# Altium schematic sheet Sheet3.SchDoc
size A3; SheetNumber: 3; SheetTotal: 4
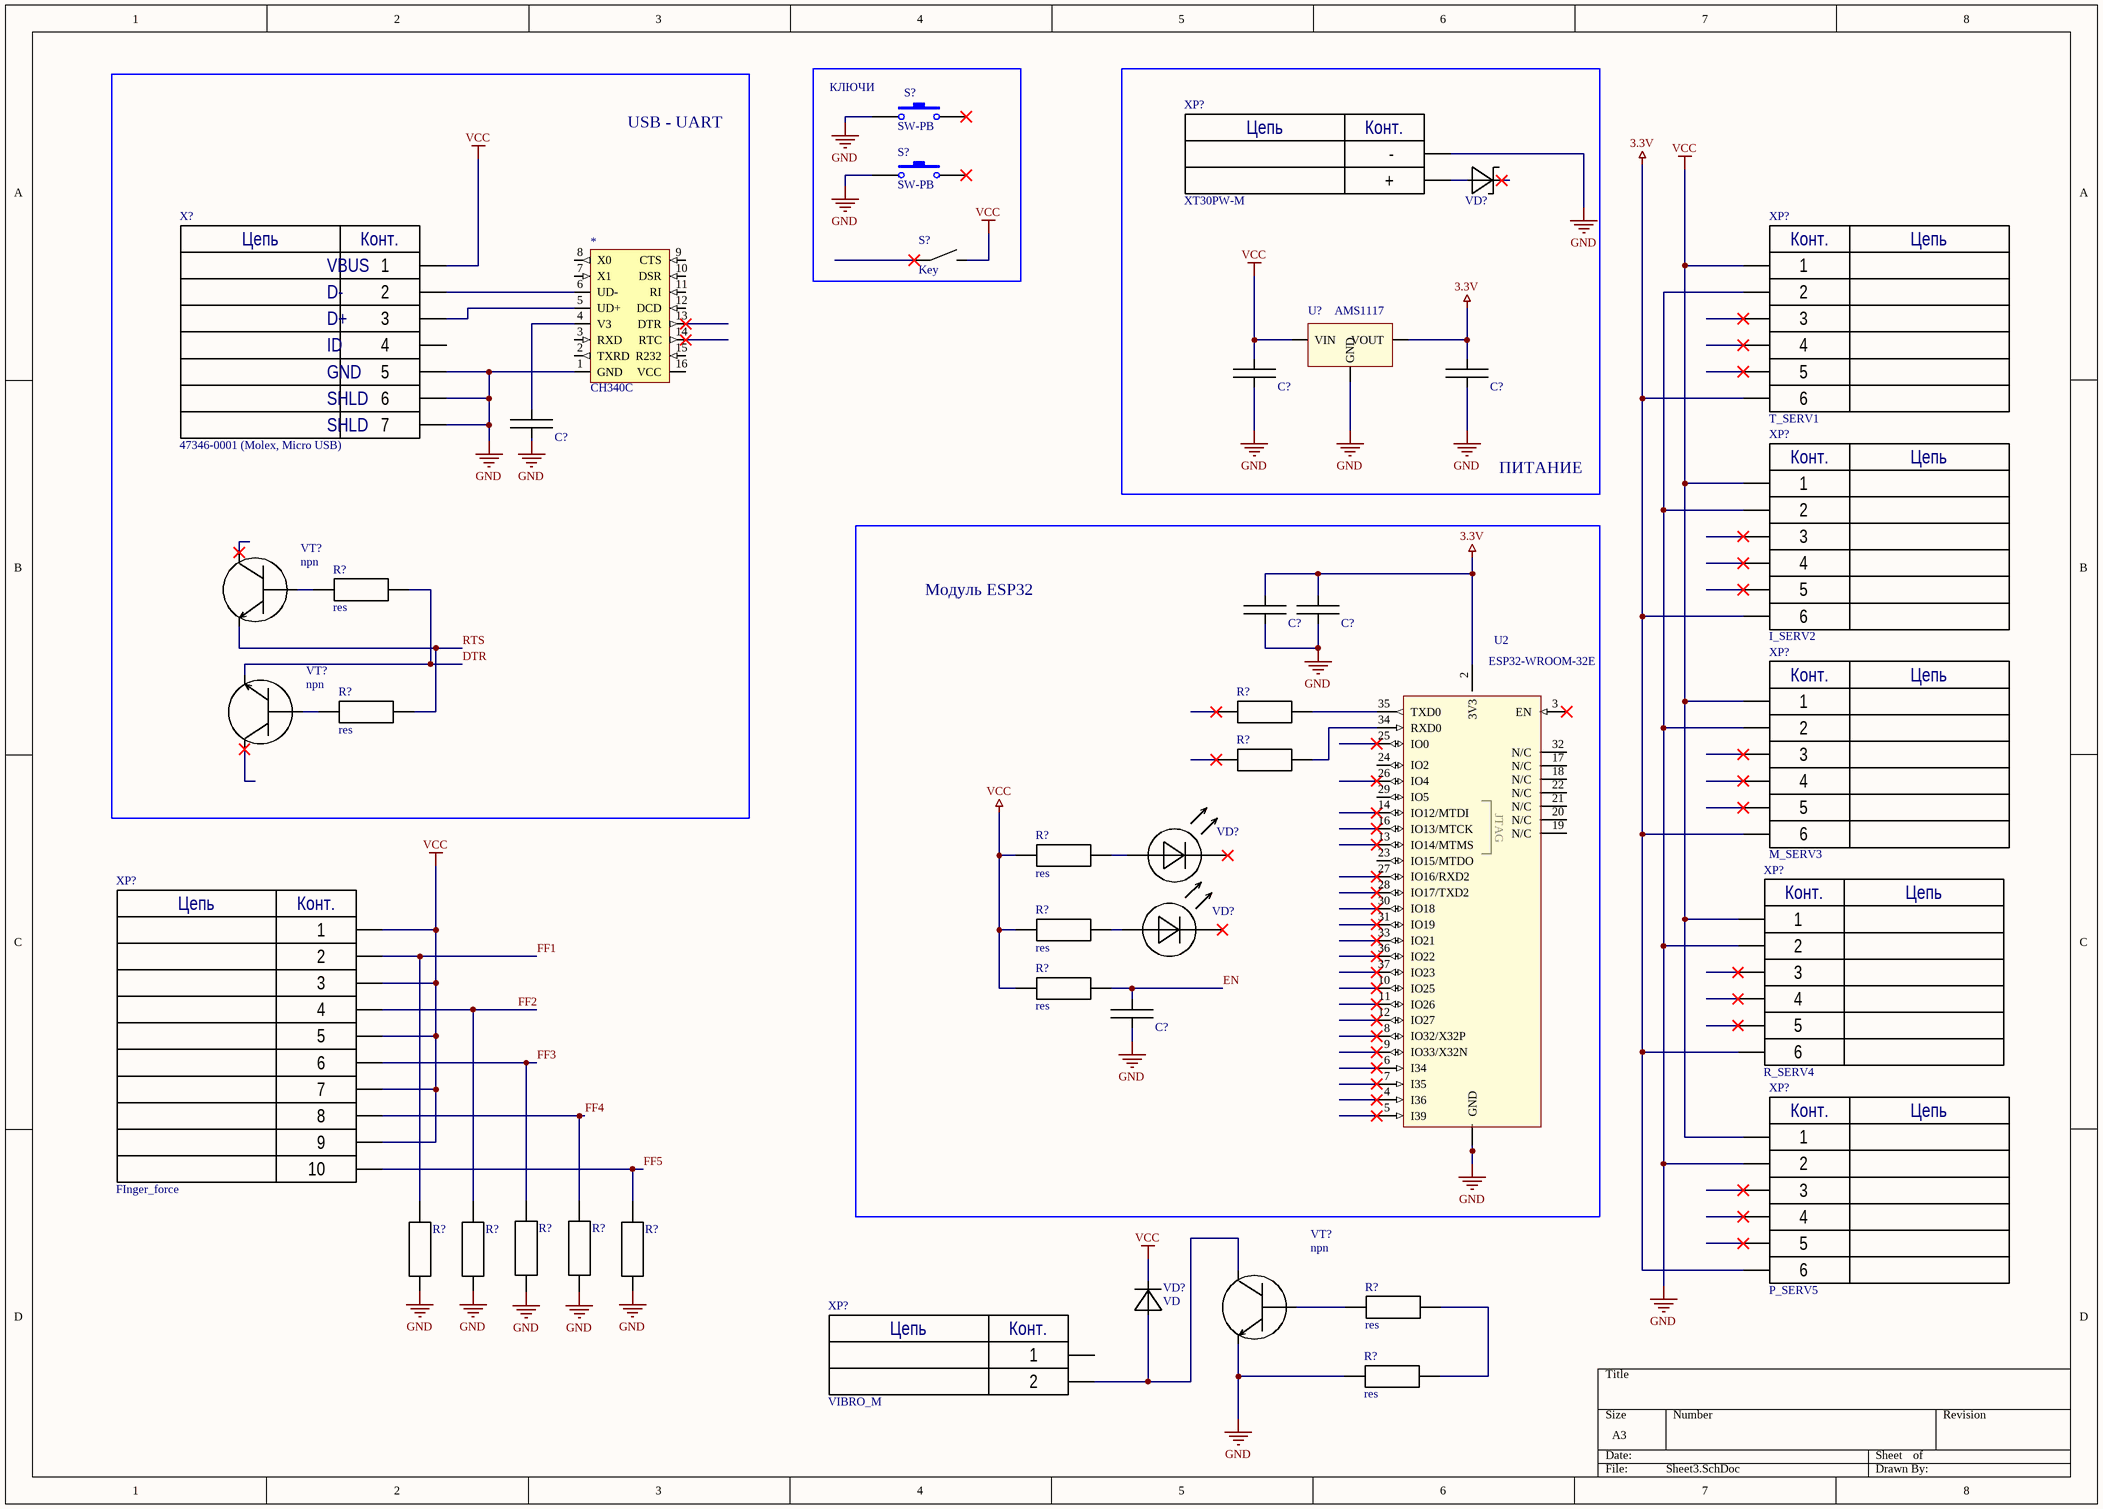
[diagram p0: Sheet3.SchDoc]

## Parts
(Parts that share a designator on the sheet are numbered #1, #2 ... from top to bottom, then left to right.)
*  CH340C  [SO-16]
C?#1  Cap  [C0805]  (value not drawn)
C?#2  Cap  [C0805]  (value not drawn)
C?#3  Cap  [C0805]  (value not drawn)
C?#4  Cap  [C0805]  (value not drawn)
C?#5  Cap  [C0805]  (value not drawn)
C?#6  Cap  [C0805]  (value not drawn)
R?#1  res  [R0805]
R?#2  res  [R0805]
R?#3  res  [R0805]  (value not drawn)
R?#4  res  [R0805]  (value not drawn)
R?#5  res  [R0805]
R?#6  res  [R0805]
R?#7  res  [R0805]
R?#8  res  [R0805]  (value not drawn)
R?#9  res  [R0805]  (value not drawn)
R?#10  res  [R0805]  (value not drawn)
R?#11  res  [R0805]  (value not drawn)
R?#12  res  [R0805]  (value not drawn)
R?#13  res  [R0805]
R?#14  res  [R0805]
S?#1  SW-PB  [SPST-2]
S?#2  SW-PB  [SPST-2]
S?#3  Key  [Key]
U2  ESP32-WROOM-32E  [ESP32-WROOM-32E]  (mechanical)
U?  AMS1117  [SOT-223]
VD?#1  Schottky diode  [DO214]  (value not drawn)
VD?#2  Led  [LED]  (value not drawn)
VD?#3  Led  [LED]  (value not drawn)
VD?#4  VD  [D0402]
VT?#1  npn  [TO-92]
VT?#2  npn  [TO-92]
VT?#3  npn  [TO-92]
X?  47346-0001 (Molex, Micro USB)  [47346-0001 (Molex, Micro USB)]
XP?#1  XT30PW-M  [XT30U-F]
XP?#2  T_SERV1  [PLS-6]
XP?#3  I_SERV2  [PLS-6]
XP?#4  M_SERV3  [PLS-6]
XP?#5  R_SERV4  [PLS-6]
XP?#6  FInger_force  [PLD-10]
XP?#7  P_SERV5  [PLS-6]
XP?#8  VIBRO_M  [PLS-2]

## Blocks framed on the sheet
КЛЮЧИ: S?#1-S?#3
ПИТАНИЕ: C?#1 C?#2 U? VD?#1 XP?#1
USB - UART: * C?#3 R?#1 R?#2 VT?#1 VT?#2 X?
Модуль ESP32: C?#4-C?#6 R?#3-R?#7 U2 VD?#2 VD?#3

## Nets
3.3V: C?#2.2 C?#4.1 C?#5.1 U2.2(3V3) U?.3(VOUT) XP?#2.6 XP?#3.6 XP?#4.6 XP?#5.6 XP?#7.6
GND: *.1(GND) C?#1.1 C?#2.1 C?#3.2 C?#4.2 C?#5.2 C?#6.2 R?#14.1 S?#1.1 S?#2.1 U2.1(GND) U2.15(GND) U2.38(GND) U2.39(GND) U?.2(GND) VT?#3.3 X?.5 X?.6 X?.7 XP?#1.1(-) XP?#2.2 XP?#3.2 XP?#4.2 XP?#5.2 XP?#7.2
VCC: C?#1.2 R?#5.1 R?#6.1 R?#7.1 S?#3.2 U?.1(VIN) VD?#4.2 X?.1 XP?#2.1 XP?#3.1 XP?#4.1 XP?#5.1 XP?#6.1 XP?#6.3 XP?#6.5 XP?#6.7 XP?#6.9 XP?#7.1
DTR: R?#1.2 VT?#2.3
EN: C?#6.1 R?#7.2
FF1: R?#8.2 XP?#6.2
FF2: R?#9.2 XP?#6.4
FF3: R?#10.2 XP?#6.6
FF4: R?#11.2 XP?#6.8
FF5: R?#12.2 XP?#6.10
RTS: R?#2.2 VT?#1.3
Net*_4: *.4(V3) C?#3.1
Net*_5: *.5(UD+) X?.3
Net*_6: *.6(UD-) X?.2
NetR?#1_1: R?#1.1 VT?#1.2
NetR?#2_1: R?#2.1 VT?#2.2
NetR?#3_2: R?#3.2 U2.35(TXD0)
NetR?#4_2: R?#4.2 U2.34(RXD0)
NetR?#5_2: R?#5.2 VD?#2.1
NetR?#6_2: R?#6.2 VD?#3.1
NetR?#13_1: R?#13.1 VT?#3.2
NetR?#13_2: R?#13.2 R?#14.2
NetVD?#1_1: VD?#1.1 XP?#1.2(+)
NetVD?#4_1: VD?#4.1 VT?#3.1 XP?#8.2

Not connected (* = marked no-connect by the designer): * 2(TXRD) 3(RXD) 7(X1) 8(X0) 9(CTS) 10(DSR) 11(RI) 12(DCD) 13(DTR)* 14(RTC)* 15(R232) 16(VCC); R?#3 1(5)*; R?#4 1(5)*; R?#8 1(5); R?#9 1(5); R?#10 1(5); R?#11 1(5); R?#12 1(5); S?#1 2*; S?#2 2*; S?#3 1*; U2 3(EN)* 4(I36)* 5(I39)* 6(I34)* 7(I35)* 8(IO32/X32P)* 9(IO33/X32N)* 10(IO25)* 11(IO26)* 12(IO27)* 13(IO14/MTMS)* 14(IO12/MTDI)* 16(IO13/MTCK)* 17(N/C) 18(N/C) 19(N/C) 20(N/C) 21(N/C) 22(N/C) 23(IO15/MTDO) 24(IO2) 25(IO0)* 26(IO4)* 27(IO16/RXD2)* 28(IO17/TXD2)* 29(IO5) 30(IO18)* 31(IO19)* 32(N/C) 33(IO21)* 36(IO22)* 37(IO23)*; VD?#1 2(4)*; VD?#2 2(4)*; VD?#3 2(4)*; VT?#1 1(11)*; VT?#2 1(11)*; X? 4; XP?#2 3* 4* 5*; XP?#3 3* 4* 5*; XP?#4 3* 4* 5*; XP?#5 3* 4* 5*; XP?#7 3* 4* 5*; XP?#8 1

## Notes on the sheet
- Labels drawn without touching a wire or pin: GND
- (in symbol 47346-0001 (Molex, Micro USB)) Цепь; Конт.; VBUS; D-; D+; ID; GND; SHLD
- (in symbol ESP32-WROOM-32E) JTAG
- (in symbol PLD-10) Цепь; Конт.
- (in symbol PLS-2) Цепь; Конт.
- (in symbol PLS-6) Конт.; Цепь
- (in symbol XT30PW-M) Цепь; Конт.

## Library data of the parts
S?#1 S?#2 = SW-PB: Switch; Published: 24-Mar-1999; LatestRevisionDate: 17-Jul-2002; LatestRevisionNote: Re-released for DXP Platform.; PackageReference: SPST-2; Publisher: Altium Limited; PackageDescription: Switch; 2 Leads
U2 = ESP32-WROOM-32E: PCB Antenna - 4,8,16 MB Flash - WiFi - BT - MCU; Manufacturer_Name: Espressif Systems; ComponentLink1Description: Datasheet; ComponentLink1URL: https://www.espressif.com/sites/default/files/documentation/esp32-wroom-32e_esp32-wroom-32ue_datasheet_en.pdf; ComponentLink2Description: SoC Datasheet; ComponentLink2URL: https://www.espressif.com/sites/default/files/documentation/esp32_datasheet_en.pdf; ComponentLink3Description: Devkit; ComponentLink3URL: https://www.espressif.com/en/products/devkits/esp32-devkitc
XP?#2-XP?#5 XP?#7 = PLS-6
XP?#6 = PLD-10
XP?#8 = PLS-2